# Altium schematic sheet 8_imu&debug_conn.SchDoc: IMU/DEBUG connectors
size A4; SheetNumber: 8; SheetTotal: 8
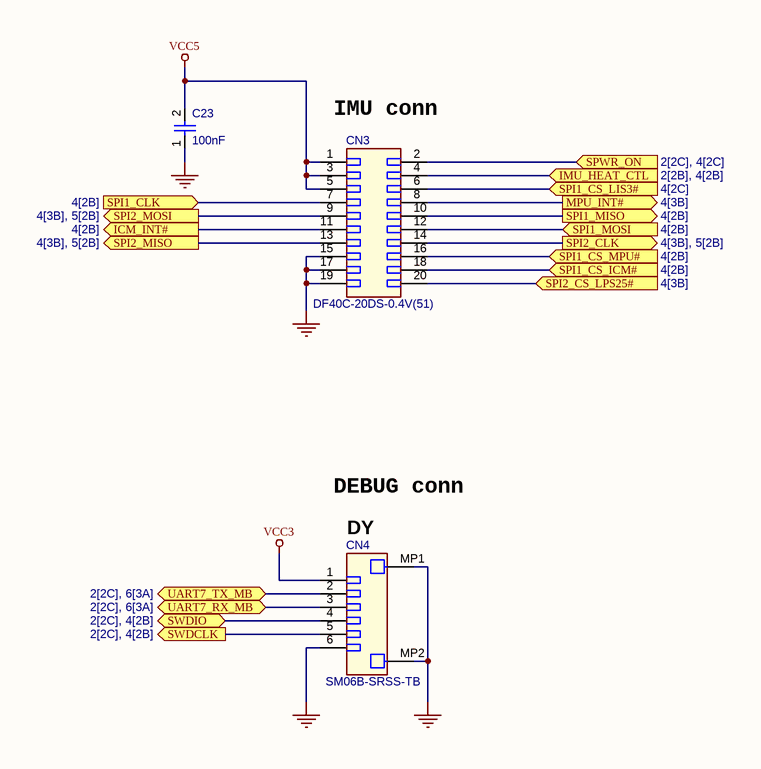
[diagram p0: 8_imu&debug_conn.SchDoc]

## Parts
C23  value 100nF  [CAPC0402(1005)60_L]  (hidden comment: Capacitor 100nF +/-20% 10V 0402)
CN3  DF40C-20DS-0.4V(51)  [HIRO-DF40C-20DS-0.4V(51)_V]
CN4  SM06B-SRSS-TB  [JST-SM06B-SRSS-TB_V]

## Ports
ICM_INT# (out, see 4[2B]), IMU_HEAT_CTL (in, see 2[2B], 4[2B]), MPU_INT# (out, see 4[3B]), SPI1_CLK (in, see 4[2B]), SPI1_CS_ICM# (in, see 4[2B]), SPI1_CS_LIS3# (in, see 4[2C]), SPI1_CS_MPU# (in, see 4[2B]), SPI1_MISO (out, see 4[2B]), SPI1_MOSI (in, see 4[2B]), SPI2_CLK (out, see 4[3B], 5[2B]), SPI2_CS_LPS25# (in, see 4[3B]), SPI2_MISO (out, see 4[3B], 5[2B]), SPI2_MOSI (out, see 4[3B], 5[2B]), SPWR_ON (in, see 2[2C], 4[2C]), SWDCLK (out, see 2[2C], 4[2B]), SWDIO (bidir, see 2[2C], 4[2B]), UART7_RX_MB (bidir, see 2[2C], 6[3A]), UART7_TX_MB (bidir, see 2[2C], 6[3A])

## Nets
GND: C23.1 CN3.15 CN3.17 CN3.19 CN4.6 CN4.MP1 CN4.MP2
VCC3: CN4.1
VCC5: C23.2 CN3.1 CN3.3 CN3.5
ICM_INT#: CN3.11 ; port ICM_INT#
IMU_HEAT_CTL: CN3.4 ; port IMU_HEAT_CTL
MPU_INT#: CN3.8 ; port MPU_INT#
SPI1_CLK: CN3.7 ; port SPI1_CLK
SPI1_CS_ICM#: CN3.18 ; port SPI1_CS_ICM#
SPI1_CS_LIS3#: CN3.6 ; port SPI1_CS_LIS3#
SPI1_CS_MPU#: CN3.16 ; port SPI1_CS_MPU#
SPI1_MISO: CN3.10 ; port SPI1_MISO
SPI1_MOSI: CN3.12 ; port SPI1_MOSI
SPI2_CLK: CN3.14 ; port SPI2_CLK
SPI2_CS_LPS25#: CN3.20 ; port SPI2_CS_LPS25#
SPI2_MISO: CN3.13 ; port SPI2_MISO
SPI2_MOSI: CN3.9 ; port SPI2_MOSI
SPWR_ON: CN3.2 ; port SPWR_ON
SWDCLK: CN4.5 ; port SWDCLK
SWDIO: CN4.4 ; port SWDIO
UART7_RX_MB: CN4.3 ; port UART7_RX_MB
UART7_TX_MB: CN4.2 ; port UART7_TX_MB

## Notes on the sheet
- (near CN3) IMU conn
- DEBUG conn
- (near CN4) DY
- Title
- Size:
- Date:
- A4
- Number:
- Time:
- Revision:
- Sheet
- of
- File:

## Library data of the parts
C23 = Capacitor 100nF +/-20% 10V 0402: Chip Capacitor, 100nF +/-20%, 10V, 0402, Thickness 0.6 mm; Manufacturer: KEMET; Manufacturer Part Number: C0402C104K8RAC; Tolerance: 20%; Min Operating Temperature: -55°C; Case/Package: 0402; Voltage Rating: 10V; Pins: 2; Mounting Technology: SMT; Max Operating Temperature: 85°C; Component Type: Capacitors
CN3 = DF40C-20DS-0.4V(51): Receptacle Connector, 30 V, 0.3 A, -35 to 85 degC, RoHS, Tape and Reel; Manufacturer: Hirose; Connector Type: Receptacle,CenterStripContacts; Pins: 20; System: Connector; Manufacturer Part Number: DF40C-20DS-0.4V(51); Component Type: Connectors
CN4 = SM06B-SRSS-TB: Male Header, Pitch 1 mm, 1 x 6 Position, Height 2.95 mm, -25 to 85 degC, RoHS, Tape and Reel; Manufacturer: JST; Manufacturer Part Number: SM06B-SRSS-TB(LF)(SN); Mounting Technology: SurfaceMount; Pins: 8; Case/Package: Male Header, Pitch 1 mm, 1 X 6 Position, Height 2.9 mm; Component Type: Connectors